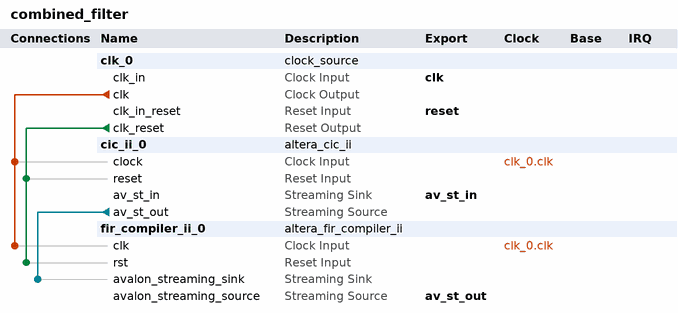
[diagram p0: system contents]
# Platform Designer (Qsys) system combined_filter, Arria V 5AGXFB3H4F35C4
# Parameters at their usual value, and those the tool derives, are not listed.
package require -exact qsys 19.1
create_system combined_filter
set_project_property DEVICE_FAMILY {Arria V}
set_project_property DEVICE 5AGXFB3H4F35C4

add_instance clk_0 clock_source 19.1
set_instance_parameter_value clk_0 clockFrequency 2000000
set_instance_parameter_value clk_0 resetSynchronousEdges BOTH

add_instance cic_ii_0 altera_cic_ii 19.1
set_instance_parameter_value cic_ii_0 CH_PER_INT 1
set_instance_parameter_value cic_ii_0 CLK_EN_PORT false
set_instance_parameter_value cic_ii_0 D_DELAY 1
set_instance_parameter_value cic_ii_0 FILTER_TYPE decimator
set_instance_parameter_value cic_ii_0 INTERFACES 1
set_instance_parameter_value cic_ii_0 IN_WIDTH 2
set_instance_parameter_value cic_ii_0 RCF_FIX 40
set_instance_parameter_value cic_ii_0 RCF_LB 8
set_instance_parameter_value cic_ii_0 RCF_UB 21
set_instance_parameter_value cic_ii_0 REQ_DIF_MEM logic_element
set_instance_parameter_value cic_ii_0 REQ_INT_MEM logic_element
set_instance_parameter_value cic_ii_0 REQ_OUT_WIDTH 16
set_instance_parameter_value cic_ii_0 REQ_PIPELINE 0
set_instance_parameter_value cic_ii_0 ROUND_TYPE H_PRUNE
set_instance_parameter_value cic_ii_0 STAGES 4
set_instance_parameter_value cic_ii_0 VRC_EN 0
set_instance_parameter_value cic_ii_0 design_env QSYS
set_instance_parameter_value cic_ii_0 hyper_opt_select 0
set_instance_parameter_value cic_ii_0 selected_device_family {Arria V}

add_instance fir_compiler_ii_0 altera_fir_compiler_ii 19.1
set_instance_parameter_value fir_compiler_ii_0 coeffBitWidth 10
set_instance_parameter_value fir_compiler_ii_0 coeffFracBitWidth 0
set_instance_parameter_value fir_compiler_ii_0 coeffReload false
set_instance_parameter_value fir_compiler_ii_0 coeffType int
set_instance_parameter_value fir_compiler_ii_0 inputBitWidth 16
set_instance_parameter_value fir_compiler_ii_0 inputChannelNum 1
set_instance_parameter_value fir_compiler_ii_0 inputFracBitWidth 0
set_instance_parameter_value fir_compiler_ii_0 inputRate 0.05
set_instance_parameter_value fir_compiler_ii_0 inputType int
set_instance_parameter_value fir_compiler_ii_0 outLsbBitRem 6
set_instance_parameter_value fir_compiler_ii_0 outMSBRound sat
set_instance_parameter_value fir_compiler_ii_0 outMsbBitRem 9
set_instance_parameter_value fir_compiler_ii_0 outType int
set_instance_parameter_value fir_compiler_ii_0 readWriteMode read_write
set_instance_parameter_value fir_compiler_ii_0 speedGrade medium

# connections
add_connection clk_0.clk cic_ii_0.clock clock
add_connection clk_0.clk fir_compiler_ii_0.clk clock
add_connection clk_0.clk_reset cic_ii_0.reset reset
add_connection clk_0.clk_reset fir_compiler_ii_0.rst reset
add_connection cic_ii_0.av_st_out fir_compiler_ii_0.avalon_streaming_sink avalon_streaming

# exported interfaces
add_interface av_st_in avalon_streaming sink
set_interface_property av_st_in EXPORT_OF cic_ii_0.av_st_in
add_interface av_st_out avalon_streaming source
set_interface_property av_st_out EXPORT_OF fir_compiler_ii_0.avalon_streaming_source
add_interface clk clock sink
set_interface_property clk EXPORT_OF clk_0.clk_in
add_interface reset reset sink
set_interface_property reset EXPORT_OF clk_0.clk_in_reset

set_interconnect_requirement {$system} qsys_mm.clockCrossingAdapter HANDSHAKE
set_interconnect_requirement {$system} qsys_mm.enableEccProtection FALSE
set_interconnect_requirement {$system} qsys_mm.insertDefaultSlave FALSE
set_interconnect_requirement {$system} qsys_mm.maxAdditionalLatency 1

save_system combined_filter.qsys
